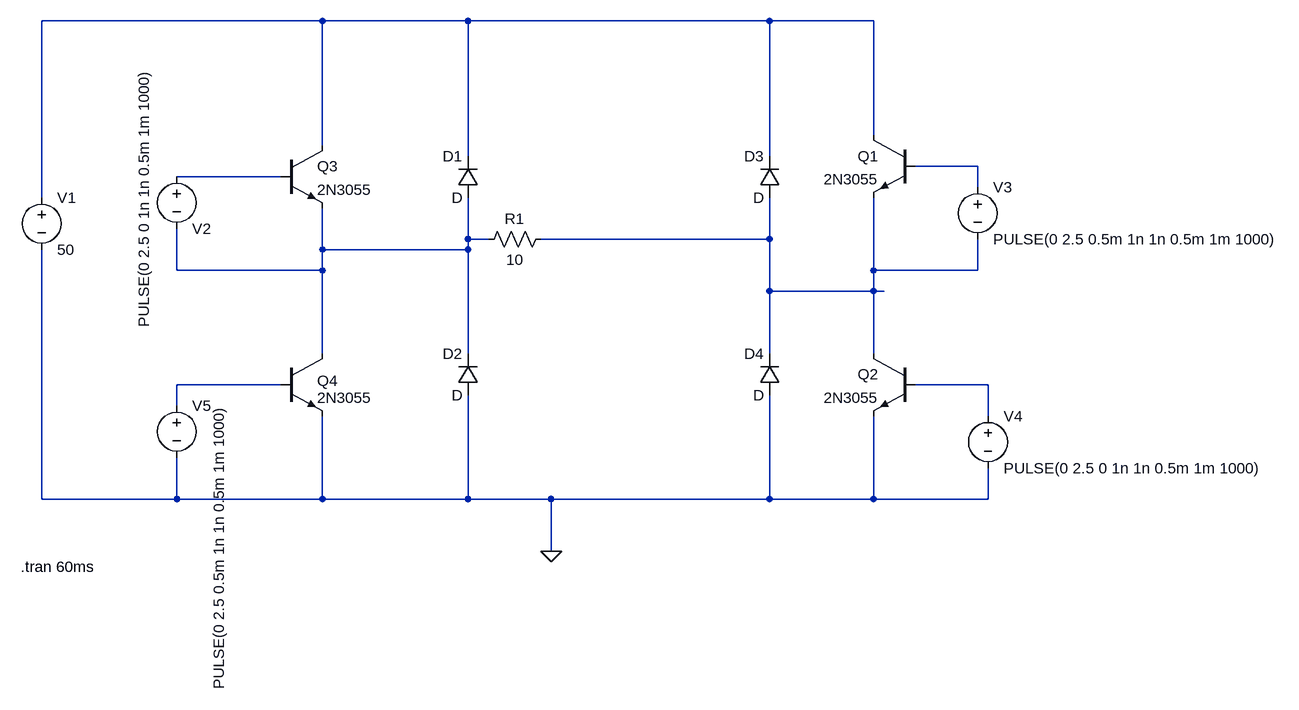
[diagram p0: schematic FULL_BRIDGE.asc]
FULL_BRIDGE.asc, the LTspice schematic file:
Version 4
SHEET 1 1112 912
WIRE -448 -144 -880 -144
WIRE -224 -144 -448 -144
WIRE 240 -144 -224 -144
WIRE 400 -144 240 -144
WIRE 400 32 400 -144
WIRE -448 48 -448 -144
WIRE -224 64 -224 -144
WIRE 240 64 240 -144
WIRE 560 80 464 80
WIRE -512 96 -672 96
WIRE 560 112 560 80
WIRE -880 128 -880 -144
WIRE -224 192 -224 128
WIRE -192 192 -224 192
WIRE 240 192 240 128
WIRE 240 192 -112 192
WIRE -448 208 -448 144
WIRE -224 208 -224 192
WIRE -224 208 -448 208
WIRE -672 240 -672 176
WIRE -448 240 -448 208
WIRE -448 240 -672 240
WIRE 400 240 400 128
WIRE 560 240 560 192
WIRE 560 240 400 240
WIRE 240 272 240 192
WIRE 400 272 400 240
WIRE 400 272 240 272
WIRE 416 272 400 272
WIRE -448 368 -448 240
WIRE -224 368 -224 208
WIRE 240 368 240 272
WIRE 400 368 400 272
WIRE -512 416 -672 416
WIRE 576 416 464 416
WIRE -672 448 -672 416
WIRE 576 464 576 416
WIRE -880 592 -880 208
WIRE -672 592 -672 528
WIRE -672 592 -880 592
WIRE -448 592 -448 464
WIRE -448 592 -672 592
WIRE -224 592 -224 432
WIRE -224 592 -448 592
WIRE -96 592 -224 592
WIRE 240 592 240 432
WIRE 240 592 -96 592
WIRE 400 592 400 464
WIRE 400 592 240 592
WIRE 576 592 576 544
WIRE 576 592 400 592
WIRE -96 672 -96 592
FLAG -96 672 0
SYMBOL npn 464 32 M0
SYMATTR InstName Q1
SYMATTR Value 2N3055
SYMBOL npn 464 368 M0
SYMATTR InstName Q2
SYMATTR Value 2N3055
SYMBOL npn -512 48 R0
SYMATTR InstName Q3
SYMATTR Value 2N3055
SYMBOL npn -512 368 R0
WINDOW 0 56 42 Left 2
SYMATTR InstName Q4
SYMATTR Value 2N3055
SYMBOL voltage -880 112 R0
WINDOW 123 0 0 Left 0
WINDOW 39 0 0 Left 0
SYMATTR InstName V1
SYMATTR Value 50
SYMBOL voltage -672 80 R0
WINDOW 0 24 96 Left 2
WINDOW 3 -51 -150 VRight 2
WINDOW 123 0 0 Left 0
WINDOW 39 0 0 Left 0
SYMATTR InstName V2
SYMATTR Value PULSE(0 2.5 0 1n 1n 0.5m 1m 1000)
SYMBOL voltage 560 96 R0
WINDOW 123 0 0 Left 0
WINDOW 39 0 0 Left 0
SYMATTR InstName V3
SYMATTR Value PULSE(0 2.5 0.5m 1n 1n 0.5m 1m 1000)
SYMBOL voltage 576 448 R0
WINDOW 123 0 0 Left 0
WINDOW 39 0 0 Left 0
SYMATTR InstName V4
SYMATTR Value PULSE(0 2.5 0 1n 1n 0.5m 1m 1000)
SYMBOL voltage -672 432 R0
WINDOW 3 65 14 VRight 2
WINDOW 123 0 0 Left 0
WINDOW 39 0 0 Left 0
SYMATTR Value PULSE(0 2.5 0.5m 1n 1n 0.5m 1m 1000)
SYMATTR InstName V5
SYMBOL diode -208 128 R180
WINDOW 0 24 64 Left 2
WINDOW 3 24 0 Left 2
SYMATTR InstName D1
SYMBOL diode -208 432 R180
WINDOW 0 24 64 Left 2
WINDOW 3 24 0 Left 2
SYMATTR InstName D2
SYMBOL diode 256 128 R180
WINDOW 0 24 64 Left 2
WINDOW 3 24 0 Left 2
SYMATTR InstName D3
SYMBOL diode 256 432 R180
WINDOW 0 24 64 Left 2
WINDOW 3 24 0 Left 2
SYMATTR InstName D4
SYMBOL res -96 176 R90
WINDOW 0 0 56 VBottom 2
WINDOW 3 32 56 VTop 2
SYMATTR InstName R1
SYMATTR Value 10
TEXT -912 696 Left 2 !.tran 60ms

The netlist it stands for:
* FULL_BRIDGE.asc
Q1 N001 N002 N005 0 2N3055
Q2 N005 N007 0 0 2N3055
Q3 N001 N003 N004 0 2N3055
Q4 N004 N006 0 0 2N3055
V1 N001 0 50
V2 N003 N004 PULSE(0 2.5 0 1n 1n 0.5m 1m 1000)
V3 N002 N005 PULSE(0 2.5 0.5m 1n 1n 0.5m 1m 1000)
V4 N007 0 PULSE(0 2.5 0 1n 1n 0.5m 1m 1000)
V5 N006 0 PULSE(0 2.5 0.5m 1n 1n 0.5m 1m 1000)
D1 N004 N001 D
D2 0 N004 D
D3 N005 N001 D
D4 0 N005 D
R1 N005 N004 10
.model D D
.lib standard.dio
.model NPN NPN
.model PNP PNP
.lib standard.bjt
.tran 60ms
.backanno
.end